# EAGLE design Motor_Board (EAGLE 9.6.2)
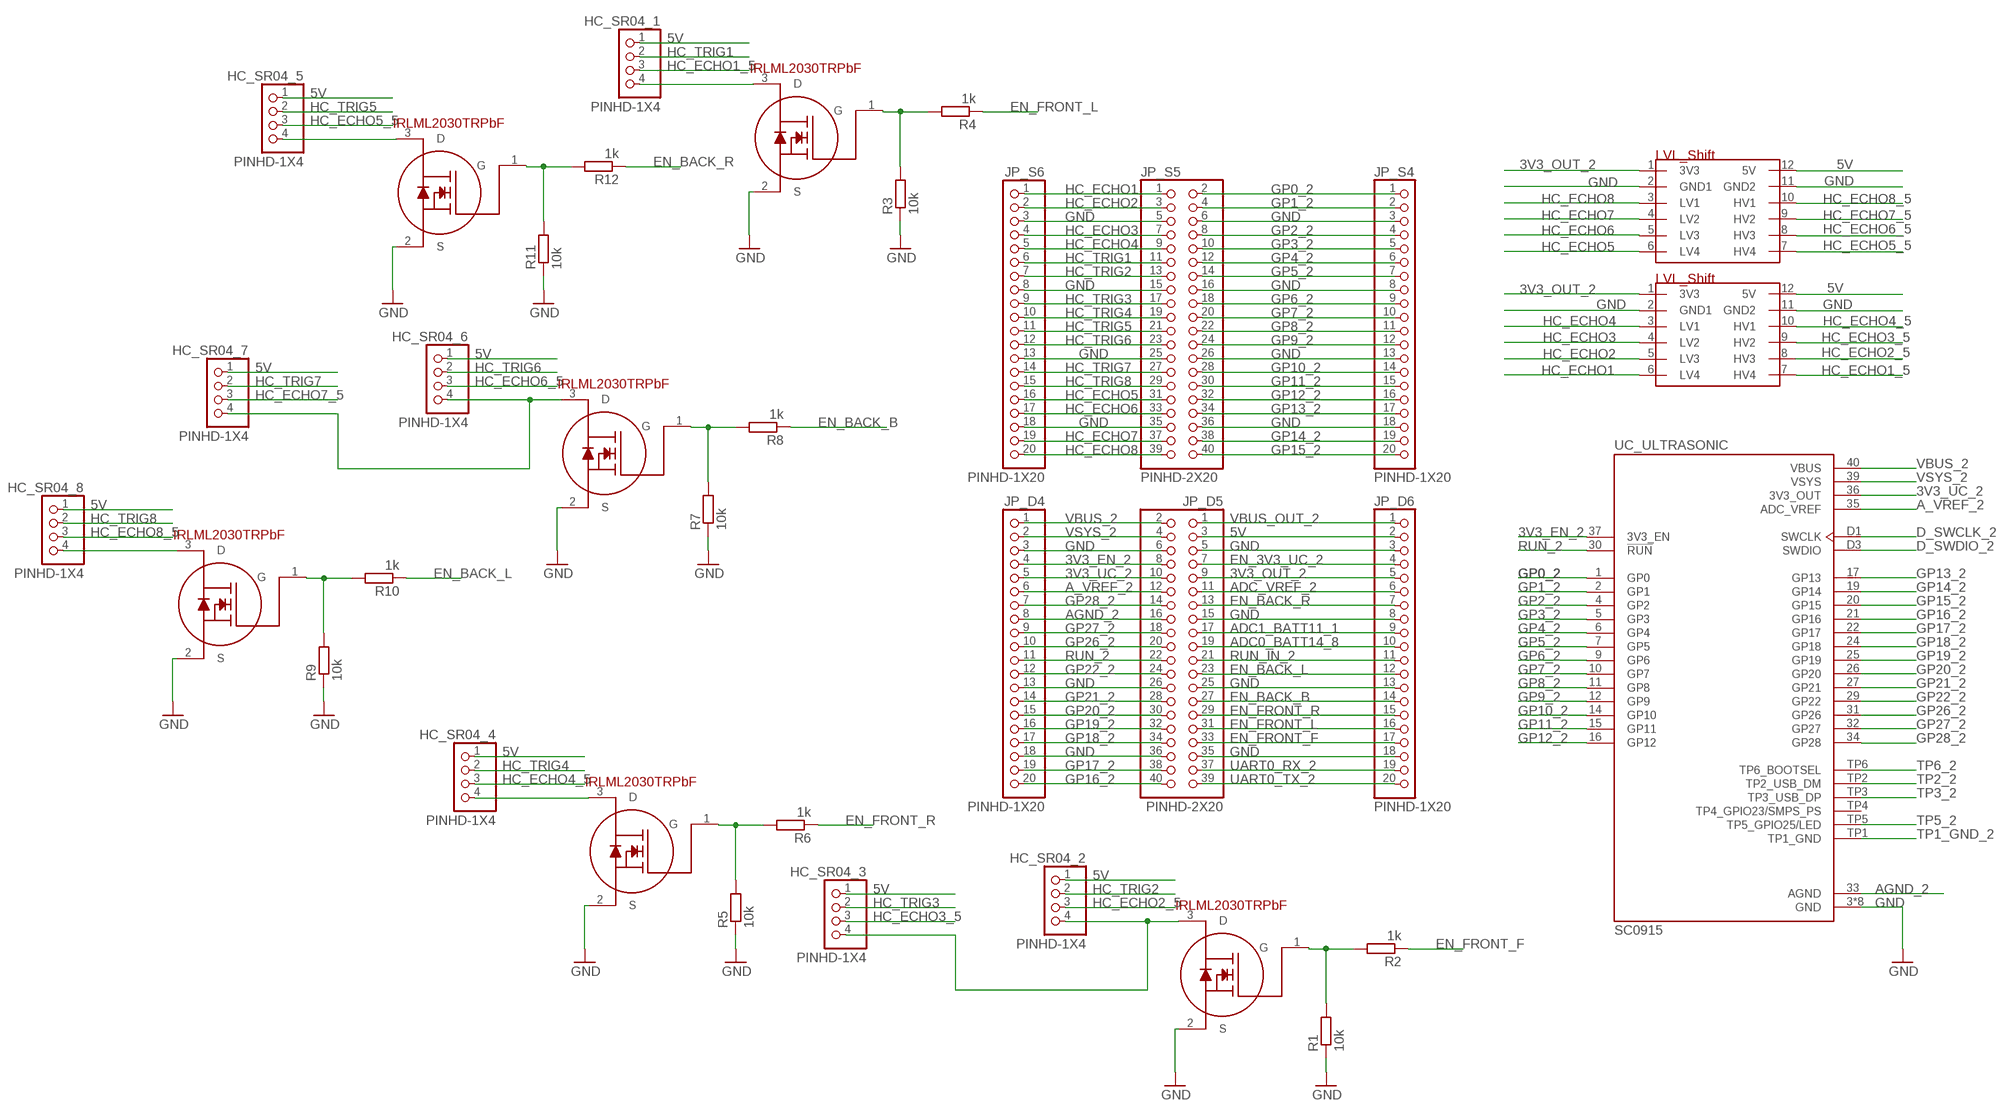
[diagram p0: schematic, sheet 1, part 1 of 2]
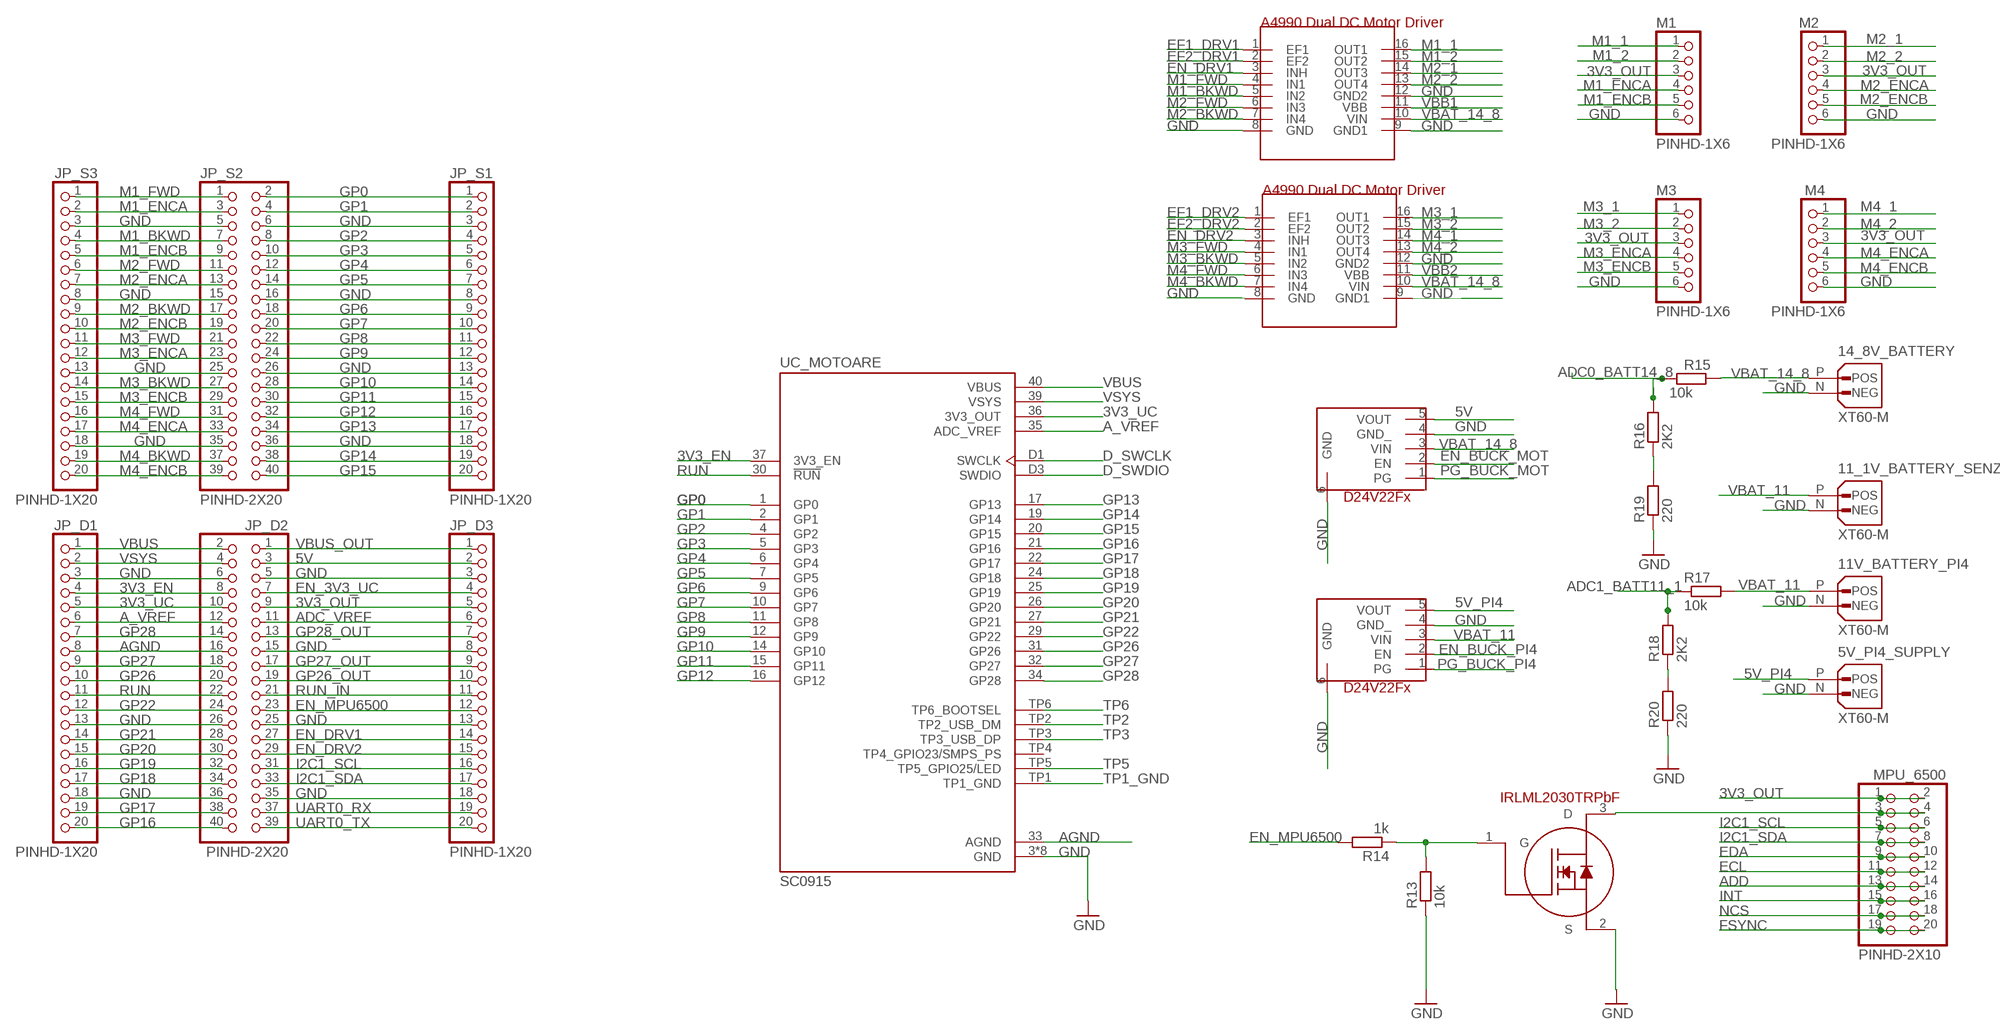
[diagram p1: schematic, sheet 1, part 2 of 2]

## Parts
5V_PI4_SUPPLY  XT60-M  [AMASS_XT60-M]
11_1V_BATTERY_SENZ  XT60-M  [AMASS_XT60-M]
11V_BATTERY_PI4  XT60-M  [AMASS_XT60-M]
14_8V_BATTERY  XT60-M  [AMASS_XT60-M]
BUCK_5V  POLOLU_BUCK_CONVERTER  [POLOLU_BUCK_FOOTPRINT]
BUCK_5V1  POLOLU_BUCK_CONVERTER  [POLOLU_BUCK_FOOTPRINT]
DRV1  A4990_DUAL  [A4990_FOOTPRINT]
DRV2  A4990_DUAL  [A4990_FOOTPRINT]
HC_SR04_1  PINHD-1X4  [1X04]
HC_SR04_2  PINHD-1X4  [1X04]
HC_SR04_3  PINHD-1X4  [1X04]
HC_SR04_4  PINHD-1X4  [1X04]
HC_SR04_5  PINHD-1X4  [1X04]
HC_SR04_6  PINHD-1X4  [1X04]
HC_SR04_7  PINHD-1X4  [1X04]
HC_SR04_8  PINHD-1X4  [1X04]
JP_D1  PINHD-1X20  [1X20]
JP_D2  PINHD-2X20  [2X20]
JP_D3  PINHD-1X20  [1X20]
JP_D4  PINHD-1X20  [1X20]
JP_D5  PINHD-2X20  [2X20]
JP_D6  PINHD-1X20  [1X20]
JP_S1  PINHD-1X20  [1X20]
JP_S2  PINHD-2X20  [2X20]
JP_S3  PINHD-1X20  [1X20]
JP_S4  PINHD-1X20  [1X20]
JP_S5  PINHD-2X20  [2X20]
JP_S6  PINHD-1X20  [1X20]
M1  PINHD-1X6  [1X06]
M2  PINHD-1X6  [1X06]
M3  PINHD-1X6  [1X06]
M4  PINHD-1X6  [1X06]
MPU_6500  PINHD-2X10  [2X10]
R1  10k  R-EU_R0805  [R0805]
R2  1k  R-EU_R0805  [R0805]
R3  10k  R-EU_R0805  [R0805]
R4  1k  R-EU_R0805  [R0805]
R5  10k  R-EU_R0805  [R0805]
R6  1k  R-EU_R0805  [R0805]
R7  10k  R-EU_R0805  [R0805]
R8  1k  R-EU_R0805  [R0805]
R9  10k  R-EU_R0805  [R0805]
R10  1k  R-EU_R0805  [R0805]
R11  10k  R-EU_R0805  [R0805]
R12  1k  R-EU_R0805  [R0805]
R13  10k  R-EU_R0805  [R0805]
R14  1k  R-EU_R0805  [R0805]
R15  10k  R-EU_R0805  [R0805]
R16  2K2  R-EU_R0805  [R0805]
R17  10k  R-EU_R0805  [R0805]
R18  2K2  R-EU_R0805  [R0805]
R19  220  R-EU_R0805  [R0805]
R20  220  R-EU_R0805  [R0805]
U$1  4_CH_BIDIRECTIONAL_LVL_SHIFTER  [LVL_SHIFT_FOOTPRINT]
U$2  4_CH_BIDIRECTIONAL_LVL_SHIFTER  [LVL_SHIFT_FOOTPRINT]
U$8  IRLML2030TRBRBF_NMOS  [IRLML2030TRPBF_FOOTPRINT]
U$9  IRLML2030TRBRBF_NMOS  [IRLML2030TRPBF_FOOTPRINT]
U$10  IRLML2030TRBRBF_NMOS  [IRLML2030TRPBF_FOOTPRINT]
U$11  IRLML2030TRBRBF_NMOS  [IRLML2030TRPBF_FOOTPRINT]
U$12  IRLML2030TRBRBF_NMOS  [IRLML2030TRPBF_FOOTPRINT]
U$13  IRLML2030TRBRBF_NMOS  [IRLML2030TRPBF_FOOTPRINT]
U$14  IRLML2030TRBRBF_NMOS  [IRLML2030TRPBF_FOOTPRINT]
UC_MOTOARE  SC0915  [MODULE_SC0915]
UC_ULTRASONIC  SC0915  [MODULE_SC0915]

## Nets
3V3_EN [Power_3V]: JP_D1.4 JP_D2.8 UC_MOTOARE.37(3V3_EN)
3V3_EN_2 [Power_3V]: JP_D4.4 JP_D5.8 UC_ULTRASONIC.37(3V3_EN)
3V3_OUT [Power_3V]: JP_D2.9 JP_D3.5 M1.3 M2.3 M3.3 M4.3 MPU_6500.1 MPU_6500.2
3V3_OUT_2 [Power_3V]: JP_D5.9 JP_D6.5 U$1.1(3V3) U$2.1(3V3)
3V3_UC [Power_3V]: JP_D1.5 JP_D2.10 UC_MOTOARE.36(3V3_OUT)
3V3_UC_2 [Power_3V]: JP_D4.5 JP_D5.10 UC_ULTRASONIC.36(3V3_OUT)
5V [Power_3V]: BUCK_5V.5(VOUT) HC_SR04_1.1 HC_SR04_2.1 HC_SR04_3.1 HC_SR04_4.1 HC_SR04_5.1 HC_SR04_6.1 HC_SR04_7.1 HC_SR04_8.1 JP_D2.3 JP_D3.2 JP_D5.3 JP_D6.2 U$1.12(5V) U$2.12(5V)
5V_PI4 [Power_3V]: 5V_PI4_SUPPLY.P(POS) BUCK_5V1.5(VOUT)
A_VREF [Power_3V]: JP_D1.6 JP_D2.12 UC_MOTOARE.35(ADC_VREF)
A_VREF_2 [Power_3V]: JP_D4.6 JP_D5.12 UC_ULTRASONIC.35(ADC_VREF)
ADC0_BATT14_8 [Power_3V]: JP_D5.19 JP_D6.10 R15.1 R16.2
ADC1_BATT11_1 [Power_3V]: JP_D5.17 JP_D6.9 R17.1 R18.2
ADC_VREF [Power_3V]: JP_D2.11 JP_D3.6
ADC_VREF_2 [Power_3V]: JP_D5.11 JP_D6.6
ADD [Power_3V]: MPU_6500.13 MPU_6500.14
AGND [Power_3V]: JP_D1.8 JP_D2.16 UC_MOTOARE.33(AGND)
AGND_2 [Power_3V]: JP_D4.8 JP_D5.16 UC_ULTRASONIC.33(AGND)
D_SWCLK [Power_3V]: UC_MOTOARE.D1(SWCLK)
D_SWCLK_2 [Power_3V]: UC_ULTRASONIC.D1(SWCLK)
D_SWDIO [Power_3V]: UC_MOTOARE.D3(SWDIO)
D_SWDIO_2 [Power_3V]: UC_ULTRASONIC.D3(SWDIO)
ECL [Power_3V]: MPU_6500.11 MPU_6500.12
EDA [Power_3V]: MPU_6500.9 MPU_6500.10
EF1_DRV1 [Power_3V]: DRV1.1(EF1)
EF1_DRV2 [Power_3V]: DRV2.1(EF1)
EF2_DRV1 [Power_3V]: DRV1.2(EF2)
EF2_DRV2 [Power_3V]: DRV2.2(EF2)
EN_3V3_UC [Power_3V]: JP_D2.7 JP_D3.4
EN_3V3_UC_2 [Power_3V]: JP_D5.7 JP_D6.4
EN_BACK_B [Power_3V]: JP_D5.27 JP_D6.14 R8.1
EN_BACK_L [Power_3V]: JP_D5.23 JP_D6.12 R10.1
EN_BACK_R [Power_3V]: JP_D5.13 JP_D6.7 R12.1
EN_BUCK_MOT [Power_3V]: BUCK_5V.2(EN)
EN_BUCK_PI4 [Power_3V]: BUCK_5V1.2(EN)
EN_DRV1 [Power_3V]: DRV1.3(INH) JP_D2.27 JP_D3.14
EN_DRV2 [Power_3V]: DRV2.3(INH) JP_D2.29 JP_D3.15
EN_FRONT_F [Power_3V]: JP_D5.33 JP_D6.17 R2.1
EN_FRONT_L [Power_3V]: JP_D5.31 JP_D6.16 R4.1
EN_FRONT_R [Power_3V]: JP_D5.29 JP_D6.15 R6.1
EN_MPU6500 [Power_3V]: JP_D2.23 JP_D3.12 R14.2
FSYNC [Power_3V]: MPU_6500.19 MPU_6500.20
GND [Power_3V]: 5V_PI4_SUPPLY.N(NEG) 11_1V_BATTERY_SENZ.N(NEG) 11V_BATTERY_PI4.N(NEG) 14_8V_BATTERY.N(NEG) BUCK_5V1.4(GND_) BUCK_5V1.6(GND) BUCK_5V.4(GND_) BUCK_5V.6(GND) DRV1.8(GND) DRV1.9(GND1) DRV1.12(GND2) DRV2.8(GND) DRV2.9(GND1) DRV2.12(GND2) JP_D1.3 JP_D1.13 JP_D1.18 JP_D2.5 JP_D2.6 JP_D2.15 JP_D2.25 JP_D2.26 JP_D2.35 JP_D2.36 JP_D3.3 JP_D3.8 JP_D3.13 JP_D3.18 JP_D4.3 JP_D4.13 JP_D4.18 JP_D5.5 JP_D5.6 JP_D5.15 JP_D5.25 JP_D5.26 JP_D5.35 JP_D5.36 JP_D6.3 JP_D6.8 JP_D6.13 JP_D6.18 JP_S1.3 JP_S1.8 JP_S1.13 JP_S1.18 JP_S2.5 JP_S2.6 JP_S2.15 JP_S2.16 JP_S2.25 JP_S2.26 JP_S2.35 JP_S2.36 JP_S3.3 JP_S3.8 JP_S3.13 JP_S3.18 JP_S4.3 JP_S4.8 JP_S4.13 JP_S4.18 JP_S5.5 JP_S5.6 JP_S5.15 JP_S5.16 JP_S5.25 JP_S5.26 JP_S5.35 JP_S5.36 JP_S6.3 JP_S6.8 JP_S6.13 JP_S6.18 M1.6 M2.6 M3.6 M4.6 R1.1 R3.1 R5.1 R7.1 R9.1 R11.1 R13.1 R19.1 R20.1 U$1.2(GND1) U$1.11(GND2) U$2.2(GND1) U$2.11(GND2) U$8.2(S) U$9.2(S) U$10.2(S) U$11.2(S) U$12.2(S) U$13.2(S) U$14.2(S) UC_MOTOARE.3(GND) UC_MOTOARE.8(GND) UC_MOTOARE.13(GND) UC_MOTOARE.18(GND) UC_MOTOARE.23(GND) UC_MOTOARE.28(GND) UC_MOTOARE.38(GND) UC_MOTOARE.D2(GND) UC_ULTRASONIC.3(GND) UC_ULTRASONIC.8(GND) UC_ULTRASONIC.13(GND) UC_ULTRASONIC.18(GND) UC_ULTRASONIC.23(GND) UC_ULTRASONIC.28(GND) UC_ULTRASONIC.38(GND) UC_ULTRASONIC.D2(GND)
GP0 [Power_3V]: JP_S1.1 JP_S2.2 UC_MOTOARE.1(GP0)
GP0_2 [Power_3V]: JP_S4.1 JP_S5.2 UC_ULTRASONIC.1(GP0)
GP1 [Power_3V]: JP_S1.2 JP_S2.4 UC_MOTOARE.2(GP1)
GP1_2 [Power_3V]: JP_S4.2 JP_S5.4 UC_ULTRASONIC.2(GP1)
GP2 [Power_3V]: JP_S1.4 JP_S2.8 UC_MOTOARE.4(GP2)
GP2_2 [Power_3V]: JP_S4.4 JP_S5.8 UC_ULTRASONIC.4(GP2)
GP3 [Power_3V]: JP_S1.5 JP_S2.10 UC_MOTOARE.5(GP3)
GP3_2 [Power_3V]: JP_S4.5 JP_S5.10 UC_ULTRASONIC.5(GP3)
GP4 [Power_3V]: JP_S1.6 JP_S2.12 UC_MOTOARE.6(GP4)
GP4_2 [Power_3V]: JP_S4.6 JP_S5.12 UC_ULTRASONIC.6(GP4)
GP5 [Power_3V]: JP_S1.7 JP_S2.14 UC_MOTOARE.7(GP5)
GP5_2 [Power_3V]: JP_S4.7 JP_S5.14 UC_ULTRASONIC.7(GP5)
GP6 [Power_3V]: JP_S1.9 JP_S2.18 UC_MOTOARE.9(GP6)
GP6_2 [Power_3V]: JP_S4.9 JP_S5.18 UC_ULTRASONIC.9(GP6)
GP7 [Power_3V]: JP_S1.10 JP_S2.20 UC_MOTOARE.10(GP7)
GP7_2 [Power_3V]: JP_S4.10 JP_S5.20 UC_ULTRASONIC.10(GP7)
GP8 [Power_3V]: JP_S1.11 JP_S2.22 UC_MOTOARE.11(GP8)
GP8_2 [Power_3V]: JP_S4.11 JP_S5.22 UC_ULTRASONIC.11(GP8)
GP9 [Power_3V]: JP_S1.12 JP_S2.24 UC_MOTOARE.12(GP9)
GP9_2 [Power_3V]: JP_S4.12 JP_S5.24 UC_ULTRASONIC.12(GP9)
GP10 [Power_3V]: JP_S1.14 JP_S2.28 UC_MOTOARE.14(GP10)
GP10_2 [Power_3V]: JP_S4.14 JP_S5.28 UC_ULTRASONIC.14(GP10)
GP11 [Power_3V]: JP_S1.15 JP_S2.30 UC_MOTOARE.15(GP11)
GP11_2 [Power_3V]: JP_S4.15 JP_S5.30 UC_ULTRASONIC.15(GP11)
GP12 [Power_3V]: JP_S1.16 JP_S2.32 UC_MOTOARE.16(GP12)
GP12_2 [Power_3V]: JP_S4.16 JP_S5.32 UC_ULTRASONIC.16(GP12)
GP13 [Power_3V]: JP_S1.17 JP_S2.34 UC_MOTOARE.17(GP13)
GP13_2 [Power_3V]: JP_S4.17 JP_S5.34 UC_ULTRASONIC.17(GP13)
GP14 [Power_3V]: JP_S1.19 JP_S2.38 UC_MOTOARE.19(GP14)
GP14_2 [Power_3V]: JP_S4.19 JP_S5.38 UC_ULTRASONIC.19(GP14)
GP15 [Power_3V]: JP_S1.20 JP_S2.40 UC_MOTOARE.20(GP15)
GP15_2 [Power_3V]: JP_S4.20 JP_S5.40 UC_ULTRASONIC.20(GP15)
GP16 [Power_3V]: JP_D1.20 JP_D2.40 UC_MOTOARE.21(GP16)
GP16_2 [Power_3V]: JP_D4.20 JP_D5.40 UC_ULTRASONIC.21(GP16)
GP17 [Power_3V]: JP_D1.19 JP_D2.38 UC_MOTOARE.22(GP17)
GP17_2 [Power_3V]: JP_D4.19 JP_D5.38 UC_ULTRASONIC.22(GP17)
GP18 [Power_3V]: JP_D1.17 JP_D2.34 UC_MOTOARE.24(GP18)
GP18_2 [Power_3V]: JP_D4.17 JP_D5.34 UC_ULTRASONIC.24(GP18)
GP19 [Power_3V]: JP_D1.16 JP_D2.32 UC_MOTOARE.25(GP19)
GP19_2 [Power_3V]: JP_D4.16 JP_D5.32 UC_ULTRASONIC.25(GP19)
GP20 [Power_3V]: JP_D1.15 JP_D2.30 UC_MOTOARE.26(GP20)
GP20_2 [Power_3V]: JP_D4.15 JP_D5.30 UC_ULTRASONIC.26(GP20)
GP21 [Power_3V]: JP_D1.14 JP_D2.28 UC_MOTOARE.27(GP21)
GP21_2 [Power_3V]: JP_D4.14 JP_D5.28 UC_ULTRASONIC.27(GP21)
GP22 [Power_3V]: JP_D1.12 JP_D2.24 UC_MOTOARE.29(GP22)
GP22_2 [Power_3V]: JP_D4.12 JP_D5.24 UC_ULTRASONIC.29(GP22)
GP26 [Power_3V]: JP_D1.10 JP_D2.20 UC_MOTOARE.31(GP26)
GP26_2 [Power_3V]: JP_D4.10 JP_D5.20 UC_ULTRASONIC.31(GP26)
GP26_OUT [Power_3V]: JP_D2.19 JP_D3.10
GP27 [Power_3V]: JP_D1.9 JP_D2.18 UC_MOTOARE.32(GP27)
GP27_2 [Power_3V]: JP_D4.9 JP_D5.18 UC_ULTRASONIC.32(GP27)
GP27_OUT [Power_3V]: JP_D2.17 JP_D3.9
GP28 [Power_3V]: JP_D1.7 JP_D2.14 UC_MOTOARE.34(GP28)
GP28_2 [Power_3V]: JP_D4.7 JP_D5.14 UC_ULTRASONIC.34(GP28)
GP28_OUT [Power_3V]: JP_D2.13 JP_D3.7
HC_ECHO1 [Power_3V]: JP_S5.1 JP_S6.1 U$2.6(LV4)
HC_ECHO1_5 [Power_3V]: HC_SR04_1.3 U$2.7(HV4)
HC_ECHO2 [Power_3V]: JP_S5.3 JP_S6.2 U$2.5(LV3)
HC_ECHO2_5 [Power_3V]: HC_SR04_2.3 U$2.8(HV3)
HC_ECHO3 [Power_3V]: JP_S5.7 JP_S6.4 U$2.4(LV2)
HC_ECHO3_5 [Power_3V]: HC_SR04_3.3 U$2.9(HV2)
HC_ECHO4 [Power_3V]: JP_S5.9 JP_S6.5 U$2.3(LV1)
HC_ECHO4_5 [Power_3V]: HC_SR04_4.3 U$2.10(HV1)
HC_ECHO5 [Power_3V]: JP_S5.31 JP_S6.16 U$1.6(LV4)
HC_ECHO5_5 [Power_3V]: HC_SR04_5.3 U$1.7(HV4)
HC_ECHO6 [Power_3V]: JP_S5.33 JP_S6.17 U$1.5(LV3)
HC_ECHO6_5 [Power_3V]: HC_SR04_6.3 U$1.8(HV3)
HC_ECHO7 [Power_3V]: JP_S5.37 JP_S6.19 U$1.4(LV2)
HC_ECHO7_5 [Power_3V]: HC_SR04_7.3 U$1.9(HV2)
HC_ECHO8 [Power_3V]: JP_S5.39 JP_S6.20 U$1.3(LV1)
HC_ECHO8_5 [Power_3V]: HC_SR04_8.3 U$1.10(HV1)
HC_TRIG1 [Power_3V]: HC_SR04_1.2 JP_S5.11 JP_S6.6
HC_TRIG2 [Power_3V]: HC_SR04_2.2 JP_S5.13 JP_S6.7
HC_TRIG3 [Power_3V]: HC_SR04_3.2 JP_S5.17 JP_S6.9
HC_TRIG4 [Power_3V]: HC_SR04_4.2 JP_S5.19 JP_S6.10
HC_TRIG5 [Power_3V]: HC_SR04_5.2 JP_S5.21 JP_S6.11
HC_TRIG6 [Power_3V]: HC_SR04_6.2 JP_S5.23 JP_S6.12
HC_TRIG7 [Power_3V]: HC_SR04_7.2 JP_S5.27 JP_S6.14
HC_TRIG8 [Power_3V]: HC_SR04_8.2 JP_S5.29 JP_S6.15
I2C1_SCL [Power_3V]: JP_D2.31 JP_D3.16 MPU_6500.5 MPU_6500.6
I2C1_SDA [Power_3V]: JP_D2.33 JP_D3.17 MPU_6500.7 MPU_6500.8
INT [Power_3V]: MPU_6500.15 MPU_6500.16
M1_1 [Power_3V]: DRV1.16(OUT1) M1.1
M1_2 [Power_3V]: DRV1.15(OUT2) M1.2
M1_BKWD [Power_3V]: DRV1.5(IN2) JP_S2.7 JP_S3.4
M1_ENCA [Power_3V]: JP_S2.3 JP_S3.2 M1.4
M1_ENCB [Power_3V]: JP_S2.9 JP_S3.5 M1.5
M1_FWD [Power_3V]: DRV1.4(IN1) JP_S2.1 JP_S3.1
M2_1 [Power_3V]: DRV1.14(OUT3) M2.1
M2_2 [Power_3V]: DRV1.13(OUT4) M2.2
M2_BKWD [Power_3V]: DRV1.7(IN4) JP_S2.17 JP_S3.9
M2_ENCA [Power_3V]: JP_S2.13 JP_S3.7 M2.4
M2_ENCB [Power_3V]: JP_S2.19 JP_S3.10 M2.5
M2_FWD [Power_3V]: DRV1.6(IN3) JP_S2.11 JP_S3.6
M3_1 [Power_3V]: DRV2.16(OUT1) M3.1
M3_2 [Power_3V]: DRV2.15(OUT2) M3.2
M3_BKWD [Power_3V]: DRV2.5(IN2) JP_S2.27 JP_S3.14
M3_ENCA [Power_3V]: JP_S2.23 JP_S3.12 M3.4
M3_ENCB [Power_3V]: JP_S2.29 JP_S3.15 M3.5
M3_FWD [Power_3V]: DRV2.4(IN1) JP_S2.21 JP_S3.11
M4_1 [Power_3V]: DRV2.14(OUT3) M4.1
M4_2 [Power_3V]: DRV2.13(OUT4) M4.2
M4_BKWD [Power_3V]: DRV2.7(IN4) JP_S2.37 JP_S3.19
M4_ENCA [Power_3V]: JP_S2.33 JP_S3.17 M4.4
M4_ENCB [Power_3V]: JP_S2.39 JP_S3.20 M4.5
M4_FWD [Power_3V]: DRV2.6(IN3) JP_S2.31 JP_S3.16
N$1 [Power_3V]: HC_SR04_1.4 U$9.3(D)
N$2 [Power_3V]: R3.2 R4.2 U$9.1(G)
N$3 [Power_3V]: HC_SR04_2.4 HC_SR04_3.4 U$10.3(D)
N$4 [Power_3V]: R1.2 R2.2 U$10.1(G)
N$5 [Power_3V]: HC_SR04_4.4 U$11.3(D)
N$6 [Power_3V]: R5.2 R6.2 U$11.1(G)
N$7 [Power_3V]: HC_SR04_5.4 U$12.3(D)
N$8 [Power_3V]: R11.2 R12.2 U$12.1(G)
N$9 [Power_3V]: R7.2 R8.2 U$13.1(G)
N$10 [Power_3V]: HC_SR04_6.4 HC_SR04_7.4 U$13.3(D)
N$11 [Power_3V]: HC_SR04_8.4 U$14.3(D)
N$12 [Power_3V]: R9.2 R10.2 U$14.1(G)
N$13 [Power_3V]: MPU_6500.3 MPU_6500.4 U$8.3(D)
N$14 [Power_3V]: R13.2 R14.1 U$8.1(G)
N$15 [Power_3V]: R16.1 R19.2
N$16 [Power_3V]: R18.1 R20.2
NCS [Power_3V]: MPU_6500.17 MPU_6500.18
PG_BUCK_MOT [Power_3V]: BUCK_5V.1(PG)
PG_BUCK_PI4 [Power_3V]: BUCK_5V1.1(PG)
RUN [Power_3V]: JP_D1.11 JP_D2.22 UC_MOTOARE.30(!RUN)
RUN_2 [Power_3V]: JP_D4.11 JP_D5.22 UC_ULTRASONIC.30(!RUN)
RUN_IN [Power_3V]: JP_D2.21 JP_D3.11
RUN_IN_2 [Power_3V]: JP_D5.21 JP_D6.11
TP1_GND [Power_3V]: UC_MOTOARE.TP1(TP1_GND)
TP1_GND_2 [Power_3V]: UC_ULTRASONIC.TP1(TP1_GND)
TP2 [Power_3V]: UC_MOTOARE.TP2(TP2_USB_DM)
TP2_2 [Power_3V]: UC_ULTRASONIC.TP2(TP2_USB_DM)
TP3 [Power_3V]: UC_MOTOARE.TP3(TP3_USB_DP)
TP3_2 [Power_3V]: UC_ULTRASONIC.TP3(TP3_USB_DP)
TP5 [Power_3V]: UC_MOTOARE.TP5(TP5_GPIO25/LED)
TP5_2 [Power_3V]: UC_ULTRASONIC.TP5(TP5_GPIO25/LED)
TP6 [Power_3V]: UC_MOTOARE.TP6(TP6_BOOTSEL)
TP6_2 [Power_3V]: UC_ULTRASONIC.TP6(TP6_BOOTSEL)
UART0_RX [Power_3V]: JP_D2.37 JP_D3.19
UART0_RX_2 [Power_3V]: JP_D5.37 JP_D6.19
UART0_TX [Power_3V]: JP_D2.39 JP_D3.20
UART0_TX_2 [Power_3V]: JP_D5.39 JP_D6.20
VBAT_11 [Power_3V]: 11_1V_BATTERY_SENZ.P(POS) 11V_BATTERY_PI4.P(POS) BUCK_5V1.3(VIN) R17.2
VBAT_14_8 [Power_3V]: 14_8V_BATTERY.P(POS) BUCK_5V.3(VIN) DRV1.10(VIN) DRV2.10(VIN) R15.2
VBB1 [Power_3V]: DRV1.11(VBB)
VBB2 [Power_3V]: DRV2.11(VBB)
VBUS [Power_3V]: JP_D1.1 JP_D2.2 UC_MOTOARE.40(VBUS)
VBUS_2 [Power_3V]: JP_D4.1 JP_D5.2 UC_ULTRASONIC.40(VBUS)
VBUS_OUT [Power_3V]: JP_D2.1 JP_D3.1
VBUS_OUT_2 [Power_3V]: JP_D5.1 JP_D6.1
VSYS [Power_3V]: JP_D1.2 JP_D2.4 UC_MOTOARE.39(VSYS)
VSYS_2 [Power_3V]: JP_D4.2 JP_D5.4 UC_ULTRASONIC.39(VSYS)
Unconnected: UC_MOTOARE.TP4(TP4_GPIO23/SMPS_PS) UC_ULTRASONIC.TP4(TP4_GPIO23/SMPS_PS)

## Library data of the parts
5V_PI4_SUPPLY 11_1V_BATTERY_SENZ 11V_BATTERY_PI4 14_8V_BATTERY = XT60-M:XT60-M; MANUFACTURER: AMASS; MAXIMUM_PACKAGE_HEIGHT: 16.00 mm; PARTREV: V1.2; STANDARD: IPC 7351B
BUCK_5V BUCK_5V1 = Step_Down:POLOLU_BUCK_CONVERTER
DRV1 DRV2 = A4990_Pololu_Dual_Motor_Driver:A4990_DUAL
HC_SR04_1-HC_SR04_8 = Connector:PINHD-1X4: PIN HEADER; CATEGORY: CONNECTOR; SUB-CATEGORY: PIN-HEADER
JP_D1 JP_D3 JP_D4 JP_D6 JP_S1 JP_S3 JP_S4 JP_S6 = Connector:PINHD-1X20: PIN HEADER; CATEGORY: CONNECTOR; SUB-CATEGORY: PIN-HEADER
JP_D2 JP_D5 JP_S2 JP_S5 = Connector:PINHD-2X20: PIN HEADER; CATEGORY: CONNECTOR; SUB-CATEGORY: PIN-HEADER
M1-M4 = Connector:PINHD-1X6: PIN HEADER; CATEGORY: CONNECTOR; SUB-CATEGORY: PIN-HEADER
MPU_6500 = Connector:PINHD-2X10: PIN HEADER; CATEGORY: CONNECTOR; SUB-CATEGORY: PIN-HEADER
R1-R20 = rcl:R-EU_: RESISTOR, European symbol; SPICEPREFIX: R
U$1 U$2 = Step_Down:4_CH_BIDIRECTIONAL_LVL_SHIFTER
U$8-U$14 = SMD_Tranzistor:IRLML2030TRBRBF_NMOS
UC_MOTOARE UC_ULTRASONIC = SC0915:SC0915: Check availability <https://pricing.snapeda.com/parts/SC0915/Raspberry%20Pi/view-part?ref=eda>; AVAILABILITY: In Stock; DESCRIPTION: RP2040 Raspberry Pi Pico series ARM® Cortex®-M0+ MCU 32-Bit Embedded Evaluation Board; MF: Raspberry Pi; MP: SC0915; PACKAGE: None; PRICE: None; PURCHASE-URL: https://pricing.snapeda.com/search/part/SC0915/?ref=eda

## Board
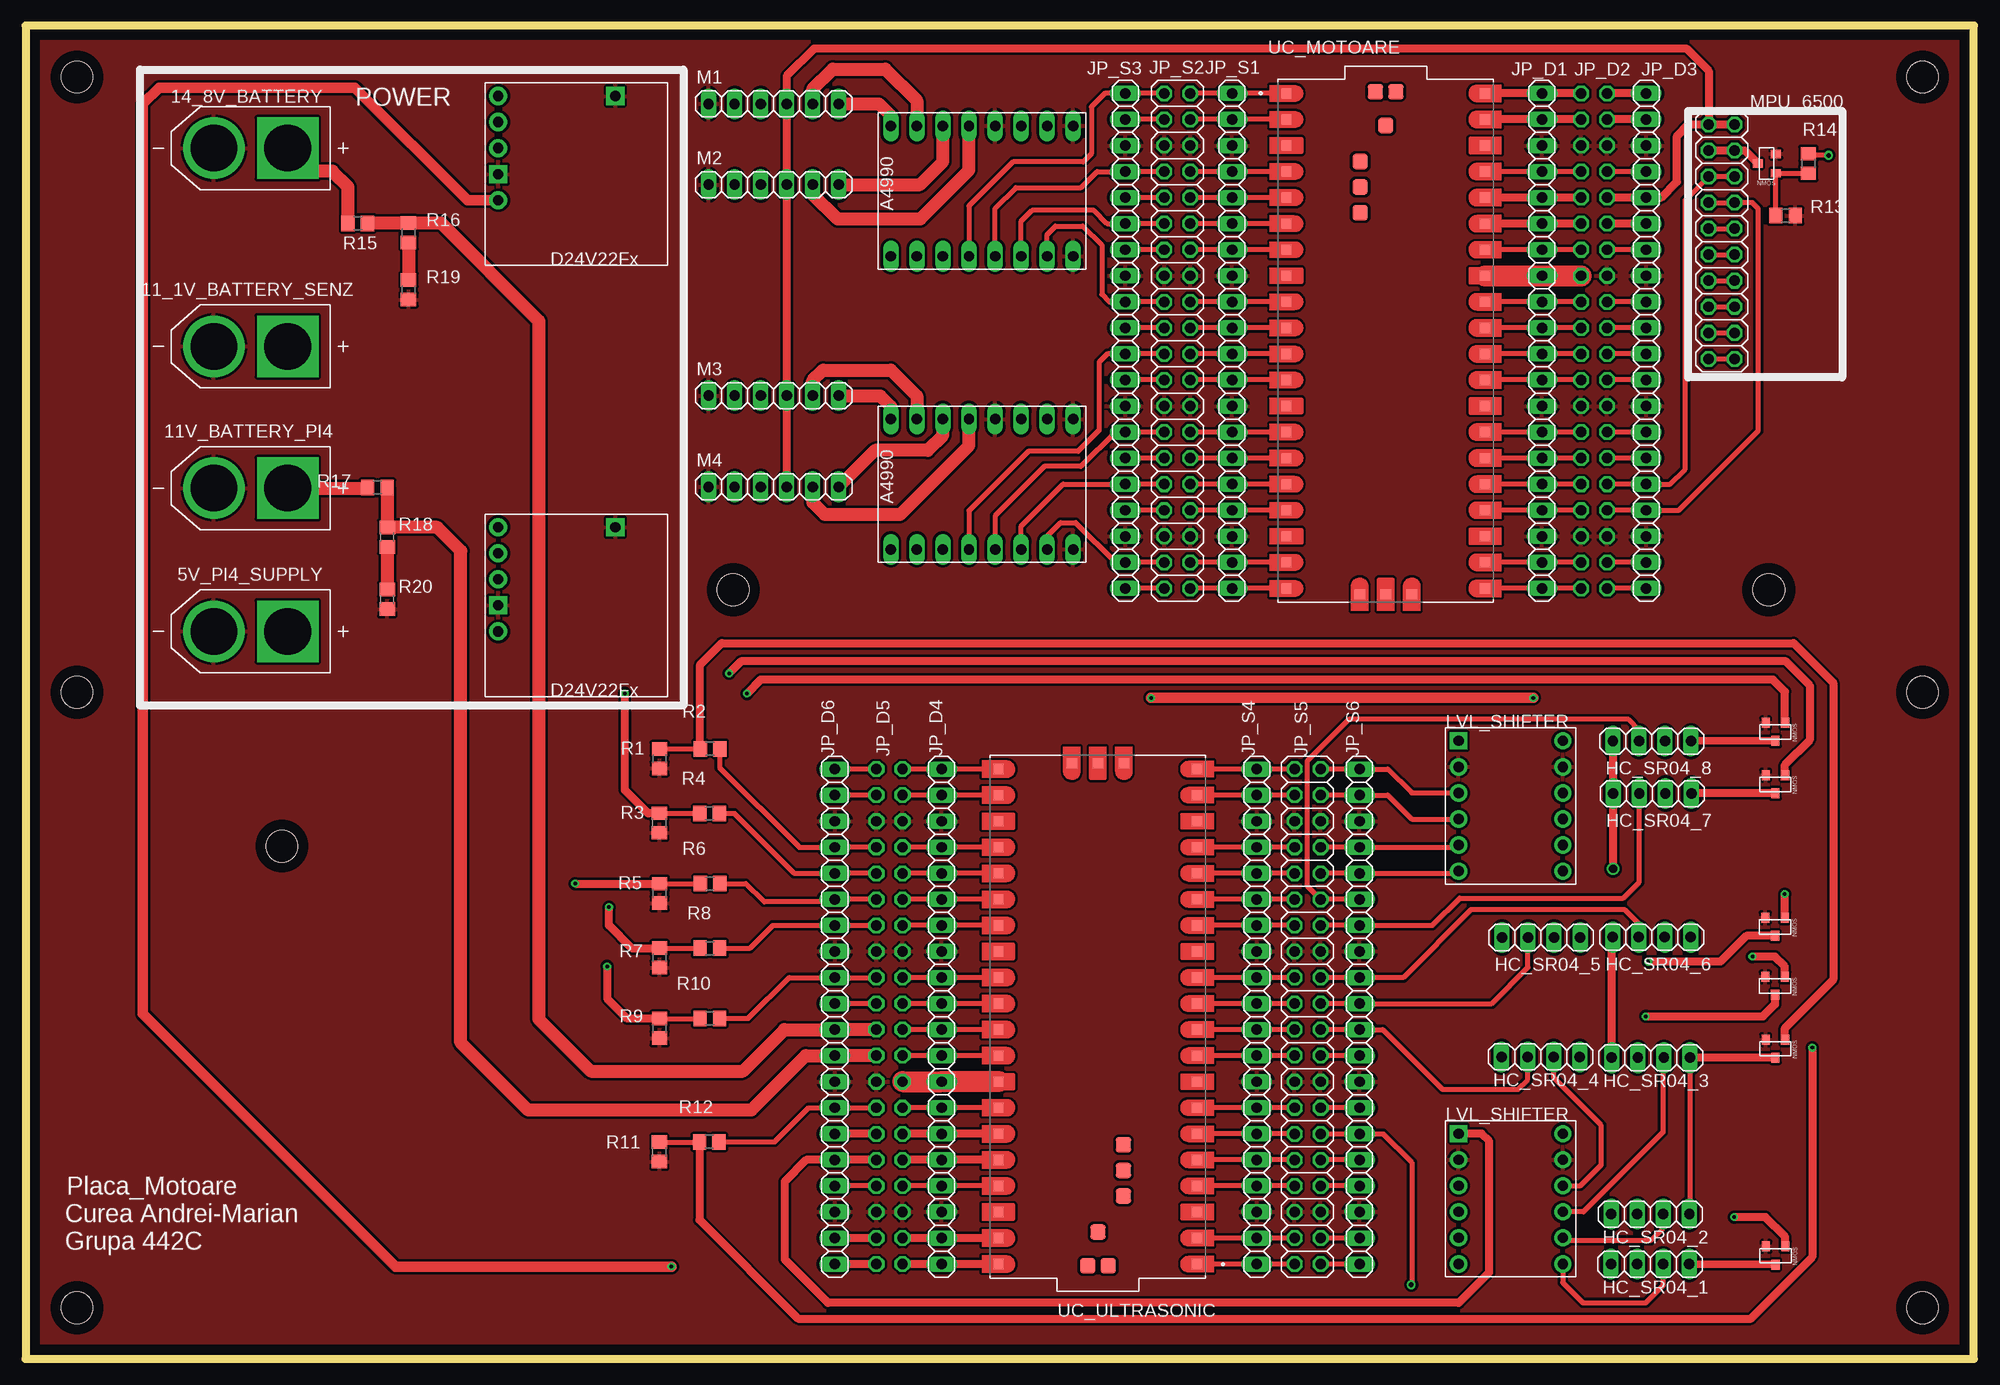
[diagram p2: board, top side]
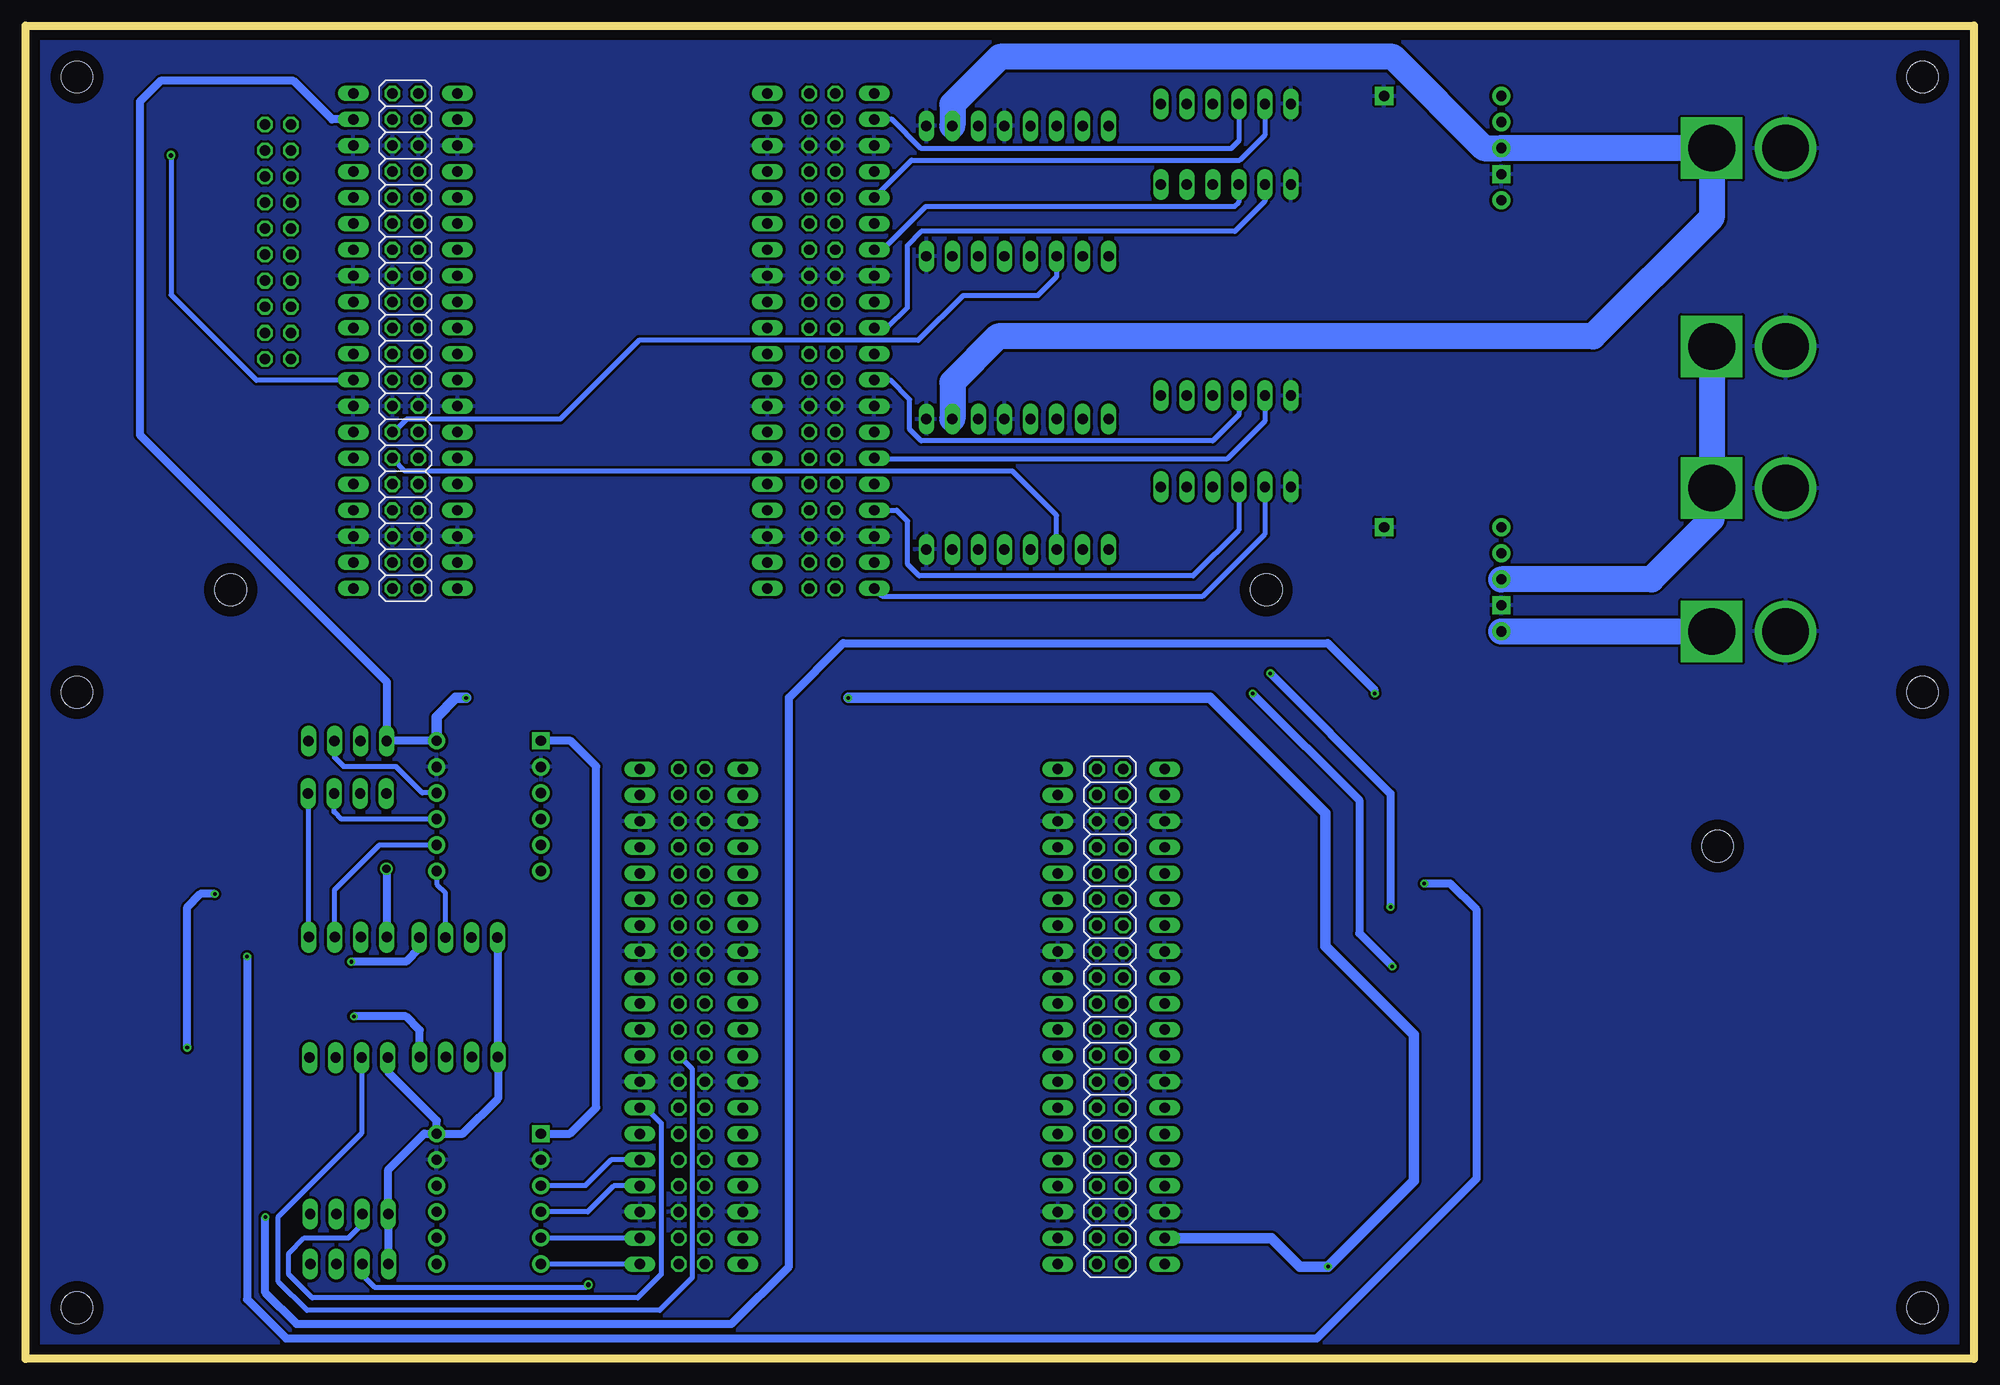
[diagram p3: board, bottom side, seen from below]

Size 190 x 130 mm. Coordinates in mm from the lower left corner, seen from the top.
Outline: 190,130 0,130 0,0 190,0 190,130
Copper layers (1*16): Top 0.035mm / dielectric 1.5mm / Bottom 0.035mm
Design rules "default *": minimum track width 8mil, minimum drill 0.3mm, track to track 8mil, track to pad 8mil, pad to pad 8mil, via to via 8mil, smd to smd 8mil, copper to edge 40mil, drill to drill 0.3mm, minimum pad ring 10mil, minimum via ring 8mil, stop-mask expansion 4mil, vias tented up to drill 0mil, thermal gap 10mil
Holes 3.1 mm at 185,125 185,5 5,5 5,125 5,65 185,65 69,75 25,50 170,75

### Footprints (pad centres in the part's own frame; a part is rotated, then mirrored left to right if it is on the bottom)
AMASS_XT60-M = drill 4.55 pad 6: N 3.6,0 | drill 4.55 pad 6 square: P -3.6,0
POLOLU_BUCK_FOOTPRINT = drill 1 pad 1.778: 1 1.27,1.27; 2 3.81,1.27; 3 6.35,1.27; 5 11.43,1.27 | drill 1 pad 1.778 square: 4 8.89,1.27; 6 1.27,12.7
A4990_FOOTPRINT = drill 1.016 long: 1 1.27,19.05; 2 1.27,16.51; 3 1.27,13.97; 4 1.27,11.43; 5 1.27,8.89; 6 1.27,6.35; 7 1.27,3.81; 8 1.27,1.27; 9 13.97,1.27; 10 13.97,3.81; 11 13.97,6.35; 12 13.97,8.89; 13 13.97,11.43; 14 13.97,13.97; 15 13.97,16.51; 16 13.97,19.05
1X04 = drill 1.016 long: 1 -3.81,0; 2 -1.27,0; 3 1.27,0; 4 3.81,0
1X20 = drill 1.016 long: 1 -24.13,0; 2 -21.59,0; 3 -19.05,0; 4 -16.51,0; 5 -13.97,0; 6 -11.43,0; 7 -8.89,0; 8 -6.35,0; 9 -3.81,0; 10 -1.27,0; 11 1.27,0; 12 3.81,0; 13 6.35,0; 14 8.89,0; 15 11.43,0; 16 13.97,0; 17 16.51,0; 18 19.05,0; 19 21.59,0; 20 24.13,0
2X20 = drill 1.016 octagon: 1 -24.13,-1.27; 2 -24.13,1.27; 3 -21.59,-1.27; 4 -21.59,1.27; 5 -19.05,-1.27; 6 -19.05,1.27; 7 -16.51,-1.27; 8 -16.51,1.27; 9 -13.97,-1.27; 10 -13.97,1.27; 11 -11.43,-1.27; 12 -11.43,1.27; 13 -8.89,-1.27; 14 -8.89,1.27; 15 -6.35,-1.27; 16 -6.35,1.27; 17 -3.81,-1.27; 18 -3.81,1.27; 19 -1.27,-1.27; 20 -1.27,1.27; 21 1.27,-1.27; 22 1.27,1.27; 23 3.81,-1.27; 24 3.81,1.27; 25 6.35,-1.27; 26 6.35,1.27; 27 8.89,-1.27; 28 8.89,1.27; 29 11.43,-1.27; 30 11.43,1.27; 31 13.97,-1.27; 32 13.97,1.27; 33 16.51,-1.27; 34 16.51,1.27; 35 19.05,-1.27; 36 19.05,1.27; 37 21.59,-1.27; 38 21.59,1.27; 39 24.13,-1.27; 40 24.13,1.27
1X06 = drill 1.016 long: 1 -6.35,0; 2 -3.81,0; 3 -1.27,0; 4 1.27,0; 5 3.81,0; 6 6.35,0
2X10 = drill 1.016 octagon: 1 -11.43,-1.27; 2 -11.43,1.27; 3 -8.89,-1.27; 4 -8.89,1.27; 5 -6.35,-1.27; 6 -6.35,1.27; 7 -3.81,-1.27; 8 -3.81,1.27; 9 -1.27,-1.27; 10 -1.27,1.27; 11 1.27,-1.27; 12 1.27,1.27; 13 3.81,-1.27; 14 3.81,1.27; 15 6.35,-1.27; 16 6.35,1.27; 17 8.89,-1.27; 18 8.89,1.27; 19 11.43,-1.27; 20 11.43,1.27
R0805 = smd 1.3 x 1.5: 1 -0.95,0; 2 0.95,0
LVL_SHIFT_FOOTPRINT = drill 1 pad 1.676 square: 1 1.27,13.97 | drill 1 pad 1.676: 2 1.27,11.43; 3 1.27,8.89; 4 1.27,6.35; 5 1.27,3.81; 6 1.27,1.27; 7 11.43,1.27; 8 11.43,3.81; 9 11.43,6.35; 10 11.43,8.89; 11 11.43,11.43; 12 11.43,13.97
IRLML2030TRPBF_FOOTPRINT = smd 0.802 x 0.972: 1 0.575,-0.2; 2 2.458,-0.2; 3 1.525,1.57
MODULE_SC0915 = smd 1 x 1: 1 -9.69,24.13; 2 -9.69,21.59; 3 -9.69,19.05; 4 -9.69,16.51; 5 -9.69,13.97; 6 -9.69,11.43; 7 -9.69,8.89; 8 -9.69,6.35; 9 -9.69,3.81; 10 -9.69,1.27; 11 -9.69,-1.27; 12 -9.69,-3.81; 13 -9.69,-6.35; 14 -9.69,-8.89; 15 -9.69,-11.43; 16 -9.69,-13.97; 17 -9.69,-16.51; 18 -9.69,-19.05; 19 -9.69,-21.59; 20 -9.69,-24.13; 21 9.69,-24.13; 22 9.69,-21.59; 23 9.69,-19.05; 24 9.69,-16.51; 25 9.69,-13.97; 26 9.69,-11.43; 27 9.69,-8.89; 28 9.69,-6.35; 29 9.69,-3.81; 30 9.69,-1.27; 31 9.69,1.27; 32 9.69,3.81; 33 9.69,6.35; 34 9.69,8.89; 35 9.69,11.43; 36 9.69,13.97; 37 9.69,16.51; 38 9.69,19.05; 39 9.69,21.59; 40 9.69,24.13; D1 -2.54,-24.7; D2 0,-24.7; D3 2.54,-24.7 | smd 1.5 x 1.5: TP1 0,21; TP2 1,24.3; TP3 -1,24.3; TP4 -2.5,17.5; TP5 -2.5,15; TP6 -2.5,12.5

### Placement (x,y rotation side)
5V_PI4_SUPPLY  21.96,70.94 180 top
11_1V_BATTERY_SENZ  21.96,98.72 180 top
11V_BATTERY_PI4  21.96,84.91 180 top
14_8V_BATTERY  21.96,118.06 180 top
BUCK_5V  44.82,124.41 270 top
BUCK_5V1  44.82,82.37 270 top
DRV1  103.43,106.25 90 top
DRV2  103.43,77.67 90 top
HC_SR04_1  158.43,9.24 0 top
HC_SR04_2  158.44,14.12 0 top
HC_SR04_3  158.5,29.38 0 top
HC_SR04_4  147.75,29.45 0 top
HC_SR04_5  147.79,41.09 0 top
HC_SR04_6  158.58,41.12 0 top
HC_SR04_7  158.64,55.13 0 top
HC_SR04_8  158.6,60.24 0 top
JP_D1  147.88,99.26 270 top
JP_D2  152.96,99.26 270 bottom
JP_D3  158.04,99.26 270 top
JP_D4  89.33,33.38 90 top
JP_D5  84.25,33.38 90 bottom
JP_D6  78.91,33.38 90 top
JP_S1  117.66,99.26 270 top
JP_S2  112.32,99.26 270 top
JP_S3  107.24,99.26 270 top
JP_S4  120.06,33.38 90 top
JP_S5  125.02,33.38 90 top
JP_S6  130.1,33.38 90 top
M1  72.95,122.38 180 top
M2  72.95,114.5 180 top
M3  72.95,93.93 180 top
M4  72.95,85.04 180 top
MPU_6500  165.41,108.94 270 top
R1  61.83,58.52 90 top
R2  66.74,59.49 180 top
R3  61.8,52.25 90 top
R4  66.69,53.19 180 top
R5  61.83,45.39 90 top
R6  66.74,46.36 180 top
R7  61.83,39.12 90 top
R8  66.72,40.06 180 top
R9  61.83,32.24 90 top
R10  66.72,33.2 180 top
R11  61.8,20.2 90 top
R12  66.67,21.16 180 top
R13  171.63,111.48 180 top
R14  173.86,116.56 90 top
R15  32.39,110.72 180 top
R16  37.34,109.81 90 top
R17  34.3,84.97 180 top
R18  35.27,80.13 90 top
R19  37.34,104.25 90 top
R20  35.27,74.06 90 top
U$1  138.48,46.3 0 top
U$2  138.48,8 0 top
U$8  170.49,115.04 90 top
U$9  172.18,10.77 180 top
U$10  172.15,30.94 180 top
U$11  172.13,37.06 180 top
U$12  172.13,42.83 180 top
U$13  172.15,56.72 180 top
U$14  172.15,61.83 180 top
UC_MOTOARE  132.64,99.26 0 top
UC_ULTRASONIC  104.57,33.38 180 top

### Tracks (layer width: path | path; a pad name or v marks a point on that pad's centre or on a via)
3V3_EN
  Top 0.508: UC_MOTOARE.37 JP_D1.4 JP_D2.8
3V3_EN_2
  Top 0.508: JP_D5.8 JP_D4.4 UC_ULTRASONIC.37
3V3_OUT
  Top 0.762: JP_D2.9 JP_D3.5 159.5,113.23 161.03,114.76 161.03,119.23 162.17,120.37 MPU_6500.1 | MPU_6500.1 MPU_6500.2 | MPU_6500.1 164.14,125.59 161.94,127.79 76.92,127.79 74.22,125.09 M1.3 M2.3 M3.3 M4.3
3V3_OUT_2
  Top 0.762: JP_D5.9 JP_D6.5 76.13,19.41 74.02,17.29 74.02,9.7 78.23,5.48 139.77,5.48 142.75,8.46 142.75,21.21 141.98,21.97 U$2.1
  Bottom 0.762: U$2.1 136.9,21.97 134.37,24.51 134.37,57.78 136.85,60.27 U$1.1
3V3_UC
  Top 0.762: UC_MOTOARE.36 JP_D1.5 JP_D2.10
3V3_UC_2
  Top 0.762: UC_ULTRASONIC.36 JP_D4.5 JP_D5.10
5V  (via drill 0.35, 0.8)
  Top 0.762: JP_D3.2 JP_D2.3 | JP_D5.3 JP_D6.2 | HC_SR04_8.1 154.79,55.17 HC_SR04_7.1 154.81,55.11 v154.81,47.8 | HC_SR04_3.1 154.69,41.04 HC_SR04_6.1
  Top 1.016: v62.99,9.01 36.07,9.01 11.43,33.65 11.43,122.38 13.02,123.96 32.11,123.96 43.09,112.98 BUCK_5V.5 | v147.04,64.45 v109.77,64.45
  Bottom 0.762: HC_SR04_1.1 HC_SR04_2.1 154.63,18.47 151.13,21.97 U$2.12 | U$2.12 149.91,23.24 154.69,28.02 HC_SR04_3.1 | U$2.12 147.37,21.96 143.94,25.39 HC_SR04_4.1 143.98,29.49 HC_SR04_5.1 | U$1.12 154.77,60.27 | 154.77,60.27 HC_SR04_8.1 | v154.81,47.8 154.79,47.77 154.79,41.14 HC_SR04_6.1 | JP_D3.2 160.11,120.85 163.88,124.62 176.83,124.62 178.86,122.58 178.86,90.1 154.77,66.01 154.77,60.27
  Bottom 1.016: JP_D6.2 68.5,11.79 65.72,9.01 v62.99,9.01 54.61,17.4 54.61,31.62 63.24,40.26 63.24,53.21 74.48,64.45 v109.77,64.45 | v147.04,64.45 148.04,64.45 149.91,62.58 U$1.12
5V_PI4
  Bottom 2.54: BUCK_5V1.5 5V_PI4_SUPPLY.P
A_VREF
  Top 0.762: UC_MOTOARE.35 JP_D1.6 JP_D2.12
A_VREF_2
  Top 0.762: JP_D5.12 JP_D4.6 UC_ULTRASONIC.35
ADC0_BATT14_8
  Top 1.27: JP_D5.19 JP_D6.10 74.01,32.11 69.96,28.06 55.12,28.06 50.04,33.14 50.04,101.22 40.5,110.76 R16.2 37.33,110.75 33.37,110.75 R15.1
ADC1_BATT11_1
  Top 1.27: JP_D5.17 JP_D6.9 76.07,29.57 70.75,24.25 49.02,24.25 42.44,30.84 42.44,78.8 40.15,81.08 R18.2 35.25,81.1 R17.1
ADC_VREF
  Top 0.762: JP_D3.6 JP_D2.11
ADC_VREF_2
  Top 0.762: JP_D5.11 JP_D6.6
ADD
  Top 0.508: MPU_6500.13 MPU_6500.14
AGND
  Top 2.032: UC_MOTOARE.33 JP_D1.8 JP_D2.16
AGND_2
  Top 2.032: JP_D5.16 JP_D4.8 UC_ULTRASONIC.33
ECL
  Top 0.508: MPU_6500.11 MPU_6500.12
EDA
  Top 0.508: MPU_6500.9 MPU_6500.10
EN_3V3_UC
  Top 0.508: JP_D3.4 JP_D2.7
EN_3V3_UC_2
  Top 0.508: JP_D5.7 JP_D6.4
EN_BACK_B
  Top 0.508: JP_D5.27 JP_D6.14 72.88,42.27 70.67,40.06 R8.1
EN_BACK_L
  Top 0.508: JP_D5.23 JP_D6.12 74.45,37.19 70.46,33.2 R10.1
EN_BACK_R
  Top 0.508: JP_D5.13 JP_D6.7 76.38,24.49 73.04,21.16 R12.1
EN_DRV1
  Top 0.508: JP_D3.14 JP_D2.27
  Bottom 0.508: DRV1.3 89.46,105.53 91.31,103.69 98.58,103.69 102.96,99.31 130.2,99.31 137.87,91.64 152.84,91.64 154.1,90.37 JP_D2.27
EN_DRV2
  Top 0.508: JP_D3.15 JP_D2.29
  Bottom 0.508: DRV2.3 89.46,82.25 93.77,86.57 153.02,86.57 154.23,87.78 JP_D2.29
EN_FRONT_F
  Top 0.508: JP_D5.33 JP_D6.17 75.45,49.89 67.69,57.65 R2.1
EN_FRONT_L
  Top 0.508: JP_D5.31 JP_D6.16 74.94,47.35 69.11,53.19 R4.1
EN_FRONT_R
  Top 0.508: JP_D5.29 JP_D6.15 78.68,44.57 72.02,44.57 70.23,46.36 R6.1
EN_MPU6500  (via drill 0.45)
  Top 0.508: JP_D3.12 JP_D2.23 | v175.83,117.35 174.01,117.35 R14.2
  Bottom 0.508: JP_D3.12 158.09,95.41 167.48,95.41 175.83,103.75 v175.83,117.35
FSYNC
  Top 0.508: MPU_6500.19 MPU_6500.20
GND
  Top 1.27: UC_MOTOARE.13 124,92.91
  pour Top (isolate 0.254): -1.85,132.7 191.15,132.7 191.15,-2.3 -1.85,-2.3
  pour Bottom (isolate 0.254): -2.85,133.7 192.15,133.7 192.15,-3.3 -2.85,-3.3
GP0
  Top 0.508: UC_MOTOARE.1 JP_S1.1 JP_S2.2
GP0_2
  Top 0.508: JP_S5.2 JP_S4.1 UC_ULTRASONIC.1
GP1
  Top 0.508: UC_MOTOARE.2 JP_S1.2 JP_S2.4
GP1_2
  Top 0.508: JP_S5.4 JP_S4.2 UC_ULTRASONIC.2
GP2
  Top 0.508: UC_MOTOARE.4 JP_S1.4 JP_S2.8
GP2_2
  Top 0.508: JP_S5.8 JP_S4.4 UC_ULTRASONIC.4
GP3
  Top 0.508: UC_MOTOARE.5 JP_S1.5 JP_S2.10
GP3_2
  Top 0.508: JP_S5.10 JP_S4.5 UC_ULTRASONIC.5
GP4
  Top 0.508: UC_MOTOARE.6 JP_S1.6 JP_S2.12
GP4_2
  Top 0.508: JP_S5.12 JP_S4.6 UC_ULTRASONIC.6
GP5
  Top 0.508: UC_MOTOARE.7 JP_S1.7 JP_S2.14
GP5_2
  Top 0.508: UC_ULTRASONIC.7 JP_S4.7 JP_S5.14
GP6
  Top 0.508: UC_MOTOARE.9 JP_S1.9 JP_S2.18
GP6_2
  Top 0.508: JP_S5.18 JP_S4.9 UC_ULTRASONIC.9
GP7
  Top 0.508: UC_MOTOARE.10 JP_S1.10 JP_S2.20
GP7_2
  Top 0.508: JP_S5.20 JP_S4.10 UC_ULTRASONIC.10
GP8
  Top 0.508: UC_MOTOARE.11 JP_S1.11 JP_S2.22
GP8_2
  Top 0.508: JP_S5.22 JP_S4.11 UC_ULTRASONIC.11
GP9
  Top 0.508: UC_MOTOARE.12 JP_S1.12 JP_S2.24
GP9_2
  Top 0.508: JP_S5.24 JP_S4.12 UC_ULTRASONIC.12
GP10
  Top 0.508: UC_MOTOARE.14 JP_S1.14 JP_S2.28
GP10_2
  Top 0.508: JP_S5.28 JP_S4.14 UC_ULTRASONIC.14
GP11
  Top 0.508: UC_MOTOARE.15 JP_S1.15 JP_S2.30
GP11_2
  Top 0.508: JP_S5.30 JP_S4.15 UC_ULTRASONIC.15
GP12
  Top 0.508: UC_MOTOARE.16 JP_S1.16 JP_S2.32
GP12_2
  Top 0.508: JP_S5.32 JP_S4.16 UC_ULTRASONIC.16
GP13
  Top 0.508: UC_MOTOARE.17 JP_S1.17 JP_S2.34
GP13_2
  Top 0.508: UC_ULTRASONIC.17 JP_S4.17 JP_S5.34
GP14
  Top 0.508: UC_MOTOARE.19 JP_S1.19 JP_S2.38
GP14_2
  Top 0.508: JP_S5.38 JP_S4.19 UC_ULTRASONIC.19
GP15
  Top 0.508: UC_MOTOARE.20 JP_S1.20 JP_S2.40
GP15_2
  Top 0.508: JP_S5.40 JP_S4.20 UC_ULTRASONIC.20
GP16
  Top 0.508: UC_MOTOARE.21 JP_D1.20 JP_D2.40
GP16_2
  Top 0.508: UC_ULTRASONIC.21 JP_D4.20 JP_D5.40
GP17
  Top 0.508: UC_MOTOARE.22 JP_D1.19 JP_D2.38
GP17_2
  Top 0.508: UC_ULTRASONIC.22 JP_D4.19 JP_D5.38
GP18
  Top 0.508: UC_MOTOARE.24 JP_D1.17 JP_D2.34
GP18_2
  Top 0.508: UC_ULTRASONIC.24 JP_D4.17 JP_D5.34
GP19
  Top 0.508: UC_MOTOARE.25 JP_D1.16 JP_D2.32
GP19_2
  Top 0.508: UC_ULTRASONIC.25 JP_D4.16 JP_D5.32
GP20
  Top 0.508: UC_MOTOARE.26 JP_D1.15 JP_D2.30
GP20_2
  Top 0.508: UC_ULTRASONIC.26 JP_D4.15 JP_D5.30
GP21
  Top 0.508: UC_MOTOARE.27 JP_D1.14 JP_D2.28
GP21_2
  Top 0.508: UC_ULTRASONIC.27 JP_D4.14 JP_D5.28
GP22
  Top 0.508: UC_MOTOARE.29 JP_D1.12 JP_D2.24
GP22_2
  Top 0.508: UC_ULTRASONIC.29 JP_D4.12 JP_D5.24
GP26
  Top 0.508: UC_MOTOARE.31 JP_D1.10 JP_D2.20
GP26_2
  Top 0.508: UC_ULTRASONIC.31 JP_D4.10 JP_D5.20
GP26_OUT
  Top 0.508: JP_D3.10 JP_D2.19
GP27
  Top 0.508: UC_MOTOARE.32 JP_D1.9 JP_D2.18
GP27_2
  Top 0.508: UC_ULTRASONIC.32 JP_D4.9 JP_D5.18
GP27_OUT
  Top 0.508: JP_D3.9 JP_D2.17
GP28
  Top 0.508: UC_MOTOARE.34 JP_D1.7 JP_D2.14
GP28_2
  Top 0.508: UC_ULTRASONIC.34 JP_D4.7 JP_D5.14
GP28_OUT
  Top 0.508: JP_D3.7 JP_D2.13
HC_ECHO1
  Top 0.508: JP_S6.1 JP_S5.1
  Bottom 0.508: JP_S6.1 139.73,9.25 U$2.6
HC_ECHO1_5
  Top 0.508: U$2.7 149.91,7.44 151.89,5.46 157.99,5.46 159.7,7.17 HC_SR04_1.3
HC_ECHO2
  Top 0.508: JP_S6.2 JP_S5.3
  Bottom 0.508: JP_S6.2 139.73,11.79 U$2.5
HC_ECHO2_5
  Top 0.508: U$2.8 150.16,11.55 158.5,11.55 159.71,12.77 HC_SR04_2.3
HC_ECHO3
  Top 0.508: JP_S6.4 JP_S5.7
  Bottom 0.508: JP_S6.4 132.65,16.87 135.18,14.35 U$2.4
HC_ECHO3_5
  Top 0.508: U$2.9 151.94,14.35 159.69,22.1 159.69,29.3 HC_SR04_3.3
HC_ECHO4
  Top 0.508: JP_S6.5 JP_S5.9
  Bottom 0.508: JP_S6.5 132.91,19.41 135.43,16.89 U$2.3
HC_ECHO4_5
  Top 0.508: HC_SR04_4.3 149.02,27.42 153.67,22.77 153.67,18.92 151.64,16.89 U$2.10
HC_ECHO5
  Top 0.508: JP_S5.31 JP_S6.16 139.53,47.35 U$1.6
HC_ECHO5_5
  Bottom 0.508: U$1.7 149.91,46.3 149.06,45.45 HC_SR04_5.3
HC_ECHO6
  Top 0.508: JP_S5.33 JP_S6.17 139.53,49.89 U$1.5
HC_ECHO6_5
  Bottom 0.508: U$1.8 155.5,50.1 159.85,45.76 HC_SR04_6.3
HC_ECHO7
  Top 0.508: JP_S5.37 JP_S6.19 132.85,54.97 135.18,52.65 U$1.4
HC_ECHO7_5
  Bottom 0.508: U$1.9 159.21,52.65 159.91,53.35 HC_SR04_7.3
HC_ECHO8
  Top 0.508: JP_S5.39 JP_S6.20 132.85,57.51 135.18,55.19 U$1.3
HC_ECHO8_5
  Bottom 0.508: U$1.10 151.33,55.19 153.92,57.78 159,57.78 159.87,58.65 HC_SR04_8.3
HC_TRIG1  (via drill 0.45)
  Top 0.508: JP_S5.11 JP_S6.6 132.38,21.95 135.18,19.16 135.18,7.28 v135.13,7.24
  Bottom 0.508: HC_SR04_1.2 157.16,8.19 155.96,6.98 135.38,6.98 v135.13,7.24
HC_TRIG2
  Top 0.508: JP_S6.7 JP_S5.13
  Bottom 0.508: JP_S6.7 129.52,24.49 128.01,22.98 128.01,8.25 130.3,5.97 162.05,5.97 164.34,8.25 164.34,10.28 162.81,11.81 158.51,11.81 157.17,13.15 HC_SR04_2.2
HC_TRIG3
  Top 0.508: JP_S6.9 JP_S5.17
  Bottom 0.508: HC_SR04_3.2 157.23,22.01 165.35,13.88 165.35,7.54 162.56,4.74 128.17,4.74 124.99,7.92 124.99,28.28 JP_S5.17
HC_TRIG4
  Top 0.508: JP_S5.19 JP_S6.10 132.35,32.11 138.18,26.29 145.54,26.29 146.48,27.23 HC_SR04_4.2
HC_TRIG5
  Top 0.508: JP_S5.21 JP_S6.11 142.99,34.65 146.52,38.19 HC_SR04_5.2
HC_TRIG6
  Top 0.508: JP_S5.23 JP_S6.12 134.35,37.19 140.97,43.81 155.96,43.81 157.31,42.46 HC_SR04_6.2
HC_TRIG7
  Top 0.508: JP_S5.27 JP_S6.14 137.21,42.27 139.86,44.92 155.8,44.92 157.37,46.5 HC_SR04_7.2
HC_TRIG8
  Top 0.508: JP_S6.15 JP_S5.29 124.97,46.13 124.97,58.29 129.05,62.37 156.33,62.37 157.33,61.37 HC_SR04_8.2
I2C1_SCL
  Top 0.508: JP_D2.31 JP_D3.16 160.37,85.29 161.84,86.77 161.84,113 MPU_6500.5 MPU_6500.6
I2C1_SDA
  Top 0.508: JP_D2.33 JP_D3.17 161.23,82.75 168.96,90.48 168.96,112.17 168.38,112.75 MPU_6500.8 MPU_6500.7
INT
  Top 0.508: MPU_6500.15 MPU_6500.16
M1_1
  Top 1.27: DRV1.16 84.38,121.21 83.22,122.38 M1.1
M1_2
  Top 1.27: M1.2 76.76,123.81 78.72,125.77 83.83,125.77 86.92,122.68 DRV1.15
M1_BKWD
  Top 0.508: JP_S2.7 JP_S3.4 104.49,115.77 102.92,114.2 96.57,114.2 94.54,112.18 DRV1.5
M1_ENCA
  Top 0.508: JP_S2.3 JP_S3.2
  Bottom 0.508: M1.4 71.68,118.77 72.44,118.01 102.66,118.01 105.5,120.85 JP_S3.2
M1_ENCB
  Top 0.508: JP_S2.9 JP_S3.5
  Bottom 0.508: M1.5 69.14,119.33 71.58,116.89 103.58,116.89 JP_S3.5
M1_FWD
  Top 0.508: JP_S2.1 JP_S3.1 105.25,123.39 103.93,122.08 103.93,117.5 103.16,116.73 96.3,116.73 92,112.43 DRV1.4
M2_1
  Top 1.27: M2.1 87.22,114.5 89.46,116.75 DRV1.14
M2_2
  Top 1.27: M2.2 76.76,113.58 79.19,111.15 87.25,111.15 92,115.9 DRV1.13
M2_BKWD
  Top 0.508: JP_S2.17 JP_S3.9 105.67,103.07 104.95,103.79 104.95,108.61 103.11,110.45 100.44,110.45 99.62,109.64 DRV1.7
M2_ENCA
  Top 0.508: JP_S2.13 JP_S3.7
  Bottom 0.508: M2.4 71.68,112.78 72.09,112.37 102.21,112.37 106.43,108.15 JP_S3.7
M2_ENCB
  Top 0.508: JP_S2.19 JP_S3.10
  Bottom 0.508: M2.5 69.14,112.88 72.08,109.93 102.66,109.93 104.03,108.56 104.03,102.47 105.97,100.53 JP_S3.10
M2_FWD
  Top 0.508: JP_S2.11 JP_S3.6 105.46,110.69 104.18,111.98 98.15,111.98 97.08,110.91 DRV1.6
M3_1
  Top 1.27: M3.1 79.35,93.88 83.36,93.88 84.38,92.86 DRV2.16
M3_2
  Top 1.27: M3.2 76.76,95.41 77.77,96.42 84.38,96.42 86.92,93.88 DRV2.15
M3_BKWD
  Top 0.508: JP_S2.27 JP_S3.14 106.27,90.37 102.92,87.02 99.36,87.02 94.54,82.2 DRV2.5
M3_ENCA
  Top 0.508: JP_S2.23 JP_S3.12
  Bottom 0.508: M3.4 71.68,92.05 74.22,89.51 102.66,89.51 103.79,90.64 103.79,93.55 105.69,95.45 JP_S3.12
M3_ENCB
  Top 0.508: JP_S2.29 JP_S3.15
  Bottom 0.508: M3.5 69.14,91.44 72.79,87.79 107.19,87.79 JP_S3.15
M3_FWD
  Top 0.508: JP_S2.21 JP_S3.11 105.5,97.99 104.69,97.18 104.69,90.54 102.65,88.5 97.79,88.5 92,82.71 DRV2.4
M4_1
  Top 1.27: M4.1 82.86,88.59 87.98,88.59 89.46,90.08 DRV2.14
M4_2
  Top 1.27: M4.2 76.76,83.51 77.95,82.33 85.26,82.33 92,89.06 DRV2.13
M4_BKWD
  Top 0.508: JP_S2.37 JP_S3.19 106.28,77.67 102.41,81.54 100.94,81.54 99.62,80.22 DRV2.7
M4_ENCA
  Top 0.508: JP_S2.33 JP_S3.17
  Bottom 0.508: JP_S3.17 105.05,82.75 103.98,81.69 103.98,77.47 102.87,76.36 76.14,76.36 71.68,80.82 M4.4
M4_ENCB
  Top 0.508: JP_S2.39 JP_S3.20
  Bottom 0.508: JP_S3.20 106.48,74.37 75.19,74.37 69.14,80.41 M4.5
M4_FWD
  Top 0.508: JP_S2.31 JP_S3.16 101.19,85.29 97.08,81.19 DRV2.6
N$1
  Top 0.762: U$9.3 162.27,9.21 HC_SR04_1.4
N$2  (via drill 0.35)
  Top 0.508: R3.2 R4.2
  Top 0.762: U$9.1 171.6,11.91 169.67,13.84 v166.62,13.84 | R3.2 60.71,53.2 58.42,55.5 v58.42,64.89
  Bottom 0.762: v58.42,64.89 58.42,65.2 63.01,69.78 110.27,69.78 115.57,64.48 115.57,9.01 121.16,3.43 163.57,3.43 166.62,6.47 v166.62,13.84
N$3
  Top 0.508: HC_SR04_3.4 162.31,14.18 HC_SR04_2.4
  Top 0.762: HC_SR04_3.4 U$10.3
N$4
  Top 0.508: R1.2 61.84,59.49 R2.2
  Top 0.762: R2.2 65.79,67.7 67.88,69.78 172.43,69.78 176.28,65.94 176.28,36.95 171.58,32.26 U$10.1
N$5  (via drill 0.35)
  Top 0.762: v157.99,33.4 169.42,33.4 170.6,34.58 U$11.3
  Bottom 0.762: HC_SR04_4.4 151.56,32.05 152.91,33.4 v157.99,33.4
N$6  (via drill 0.35)
  Top 0.508: R5.2 65.78,46.34 R6.2
  Top 0.762: U$11.1 171.55,38.28 170.59,39.24 v168.4,39.24 | v53.59,46.35 61.82,46.35 R5.2
  Bottom 0.762: v53.59,46.35 51.05,46.35 48.49,43.79 48.49,17.6 64.08,2 164.59,2 168.4,5.81 v168.4,39.24
N$7  (via drill 0.35)
  Top 0.762: U$12.3 167.82,41.26 165.29,38.73 v158.24,38.73
  Bottom 0.762: HC_SR04_5.4 151.6,40.04 152.91,38.73 v158.24,38.73
N$8  (via drill 0.35)
  Top 0.508: R11.2 65.7,21.15 R12.2
  Top 0.762: R12.2 65.72,13.55 75.33,3.93 168.25,3.93 174.24,9.93 v174.24,30.35 | U$12.1 v171.55,45.34
  Bottom 0.762: v174.24,30.35 174.24,44.07 172.97,45.34 v171.55,45.34
N$9  (via drill 0.35)
  Top 0.508: R7.2 65.76,40.07 R8.2
  Top 0.762: U$13.1 171.58,57.94 173.99,60.34 173.99,65.69 171.67,68.01 69.77,68.01 v68.61,66.85 | v56.9,44.07 56.9,42.29 59.11,40.07 R7.2
  Bottom 0.762: v68.61,66.85 56.9,55.13 v56.9,44.07
N$10
  Top 0.762: U$13.3 HC_SR04_7.4
  Bottom 0.508: HC_SR04_6.4 162.45,41.19 HC_SR04_7.4
N$11
  Top 0.762: U$14.3 HC_SR04_8.4
N$12  (via drill 0.35)
  Top 0.508: R9.2 65.75,33.19 R10.2
  Top 0.762: U$14.1 171.58,65.06 170.41,66.23 71.69,66.23 v70.34,64.88 | R9.2 58.67,33.19 56.72,35.14 v56.72,38.27
  Bottom 0.762: v70.34,64.88 59.94,54.48 59.94,41.5 v56.72,38.27
N$13
  Top 0.762: MPU_6500.3 MPU_6500.4 167.65,117.83 U$8.3
N$14
  Top 0.508: R14.1 U$8.1 170.63,115.56 170.63,111.53 R13.2
N$15
  Top 1.27: R16.1 R19.2
N$16
  Top 1.27: R18.1 R20.2
NCS
  Top 0.508: MPU_6500.17 MPU_6500.18
RUN
  Top 0.508: UC_MOTOARE.30 JP_D1.11 JP_D2.22
RUN_2
  Top 0.508: UC_ULTRASONIC.30 JP_D4.11 JP_D5.22
RUN_IN
  Top 0.508: JP_D3.11 JP_D2.21
RUN_IN_2
  Top 0.508: JP_D5.21 JP_D6.11
UART0_RX
  Top 0.508: JP_D3.19 JP_D2.37
UART0_RX_2
  Top 0.508: JP_D5.37 JP_D6.19
UART0_TX
  Top 0.508: JP_D3.20 JP_D2.39
UART0_TX_2
  Top 0.508: JP_D5.39 JP_D6.20
VBAT_11
  Top 1.27: 11V_BATTERY_PI4.P 33.29,84.91 R17.2
  Bottom 2.54: BUCK_5V1.3 31.45,76.02 25.56,81.91 11V_BATTERY_PI4.P 11_1V_BATTERY_SENZ.P
VBAT_14_8
  Top 1.27: R15.2 31.44,114.28 29.91,115.81 27.81,115.81 14_8V_BATTERY.P
  Bottom 2.54: DRV1.10 99.62,122.32 94.99,126.95 56.68,126.95 47.78,118.06 BUCK_5V.3 14_8V_BATTERY.P 25.56,111.29 37.15,99.7 95.15,99.7 99.62,95.23 DRV2.10
VBUS
  Top 0.762: UC_MOTOARE.40 JP_D1.1 JP_D2.2
VBUS_2
  Top 0.762: UC_ULTRASONIC.40 JP_D4.1 JP_D5.2
VBUS_OUT
  Top 0.762: JP_D3.1 JP_D2.1
VBUS_OUT_2
  Top 0.762: JP_D5.1 JP_D6.1
VSYS
  Top 0.762: UC_MOTOARE.39 JP_D1.2 JP_D2.4
VSYS_2
  Top 0.762: JP_D5.4 JP_D4.2 UC_ULTRASONIC.39

### Text on the board
tNames: POWER | Placa_Motoare | Curea Andrei-Marian / Grupa 442C